# EAGLE design E-P-099-R2.5 (EAGLE 7.5.0)
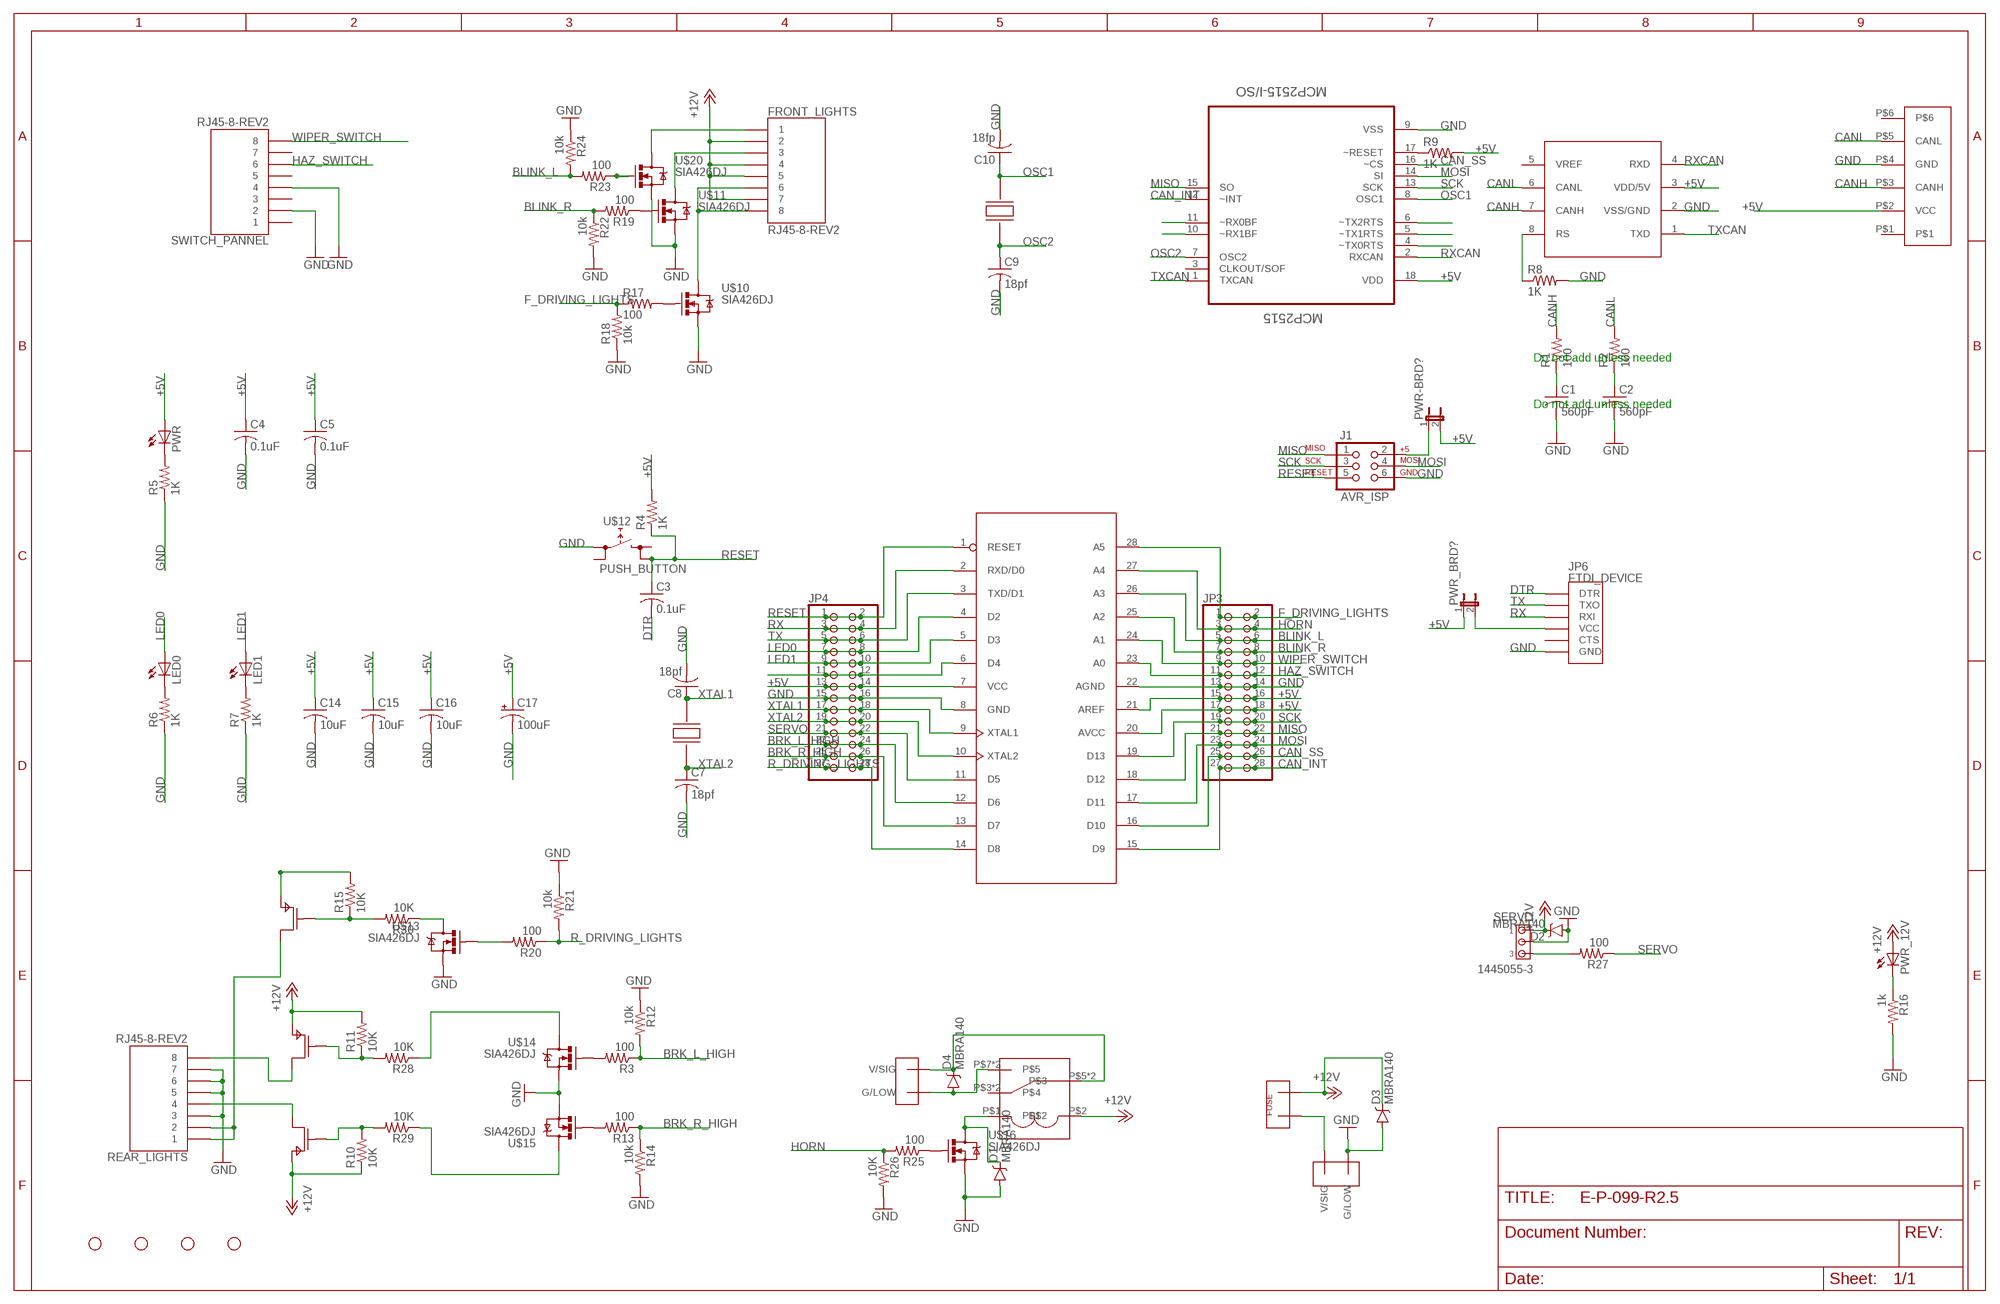
[diagram p0: schematic, sheet 1]

## Parts
C1  560pF  C-USC0805  [C0805]
C2  560pF  C-USC0805  [C0805]
C3  0.1uF  C-USC0805  [C0805]
C4  0.1uF  C-USC0805  [C0805]
C5  0.1uF  C-USC0805  [C0805]
C7  18pf  C-USC0805  [C0805]
C8  18pf  C-USC0805  [C0805]
C9  18pf  C-USC0805  [C0805]
C10  18fp  C-USC0805  [C0805]
C14  10uF  C-USC0805  [C0805]
C15  10uF  C-USC0805  [C0805]
C16  10uF  C-USC0805  [C0805]
C17  100uF  47UF-50V-20%(ELECT)  [PANASONIC_D]
CAN-BUS  CAN_6P6C  [CAN_6P6C]
D1  MBRA140  [SMA-DIODE]
D2  MBRA140  [SMA-DIODE]
D3  MBRA140  [SMA-DIODE]
D4  MBRA140  [SMA-DIODE]
FRONT_LIGHTS  RJ45-8-REV2  [RJ45-8]
HORN  TE770966  [2X1-MATE-N-LOCK]
J1  AVR_ISP  AVR_SPI_PRG_6PTH  [2X3]
JP3  PINHD-2X14  [2X14]
JP4  PINHD-2X14  [2X14]
JP6  FTDI_DEVICE  [FTDI_DEVICE_SIDE]
LED0  LED1206  [LED-1206]
LED1  LED1206  [LED-1206]
MCP2515  MCP2515-I/SO  [SOIC127P1034X264-18N]
PWR  LED1206  [LED-1206]
PWR-BRD?  JP1E  [JP1]
PWR_12V  LEDCHIPLED_1206  [CHIPLED_1206]
PWR_BRD?  JP1E  [JP1]
R1  100  R-US_M0805  [M0805]
R2  100  R-US_M0805  [M0805]
R3  100  R-US_M0805  [M0805]
R4  1K  R-US_M0805  [M0805]
R5  1K  R-US_M0805  [M0805]
R6  1K  R-US_M0805  [M0805]
R7  1K  R-US_M0805  [M0805]
R8  1K  R-US_M0805  [M0805]
R9  1K  R-US_M0805  [M0805]
R10  10K  R-US_M0805  [M0805]
R11  10K  R-US_M0805  [M0805]
R12  10k  R-US_M0805  [M0805]
R13  100  R-US_M0805  [M0805]
R14  10k  R-US_M0805  [M0805]
R15  10K  R-US_M0805  [M0805]
R16  1k  R-US_M0805  [M0805]
R17  100  R-US_M0805  [M0805]
R18  10k  R-US_M0805  [M0805]
R19  100  R-US_M0805  [M0805]
R20  100  R-US_M0805  [M0805]
R21  10k  R-US_M0805  [M0805]
R22  10k  R-US_M0805  [M0805]
R23  100  R-US_M0805  [M0805]
R24  10k  R-US_M0805  [M0805]
R25  100  R-US_M0805  [M0805]
R26  10K  R-US_M0805  [M0805]
R27  100  R-US_M0805  [M0805]
R28  10K  R-US_M0805  [M0805]
R29  10K  R-US_M0805  [M0805]
R30  10K  R-US_M0805  [M0805]
REAR_LIGHTS  RJ45-8-REV2  [RJ45-8]
SERVO  1445055-3  [1445055-3]
STANDOFF1  STAND-OFF  [STAND-OFF]
STANDOFF2  STAND-OFF  [STAND-OFF]
STANDOFF3  STAND-OFF  [STAND-OFF]
STANDOFF4  STAND-OFF  [STAND-OFF]
SWITCH_PANNEL  RJ45-8-REV2  [RJ45-8]
U$2  MCP2551DIP  [DIP8]
U$3  SIA449DJ  [SIA449DJ-T1-GE3CT-ND]
U$4  ATMEGA328  [DIP28-0.3IN]
U$5  SIA449DJ  [SIA449DJ-T1-GE3CT-ND]
U$6  SIA449DJ  [SIA449DJ-T1-GE3CT-ND]
U$7  RELAY  [RTD34012]
U$8  TE770966  [2X1-MATE-N-LOCK]
U$9  FUSEMINI-BLADE  [MINI-BLADE-FUSE]
U$10  SIA426DJ  [SC70-6L]
U$11  SIA426DJ  [SC70-6L]
U$12  PUSH_BUTTON  [PUSHBUTTON]
U$13  SIA426DJ  [SC70-6L]
U$14  SIA426DJ  [SC70-6L]
U$15  SIA426DJ  [SC70-6L]
U$16  SIA426DJ  [SC70-6L]
U$18  CRYSTAL  [7A_CRYSTAL]
U$19  CRYSTAL  [7A_CRYSTAL]
U$20  SIA426DJ  [SC70-6L]

## Nets
+5V: C4.1 C5.1 C14.1 C15.1 C16.1 C17.+ CAN-BUS.P$2(VCC) JP3.15 JP3.16 JP3.17 JP3.18 JP4.13 JP4.14 MCP2515.18(VDD) PWR-BRD?.2 PWR.A PWR_BRD?.1 R4.2 R9.2 U$2.3(VDD/5V) U$4.7(VCC) U$4.20(AVCC) U$4.21(AREF)
+12V: D2.C D3.C FRONT_LIGHTS.2 FRONT_LIGHTS.4 FRONT_LIGHTS.5 FRONT_LIGHTS.7 PWR_12V.A R10.1 R11.2 R15.2 SERVO.1 U$3.P$4(P$S) U$3.P$5(P$S) U$5.P$4(P$S) U$5.P$5(P$S) U$6.P$4(P$S) U$6.P$5(P$S) U$7.P$2 U$9.OUT
BLINK_L: JP3.5 JP3.6 R23.2 R24.2 U$4.26(A3)
BLINK_R: JP3.7 JP3.8 R19.2 R22.1 U$4.25(A2)
BRK_L_HIGH: JP4.23 JP4.24 R3.1 R12.2 U$4.12(D6)
BRK_R_HIGH: JP4.25 JP4.26 R13.1 R14.1 U$4.13(D7)
CAN_INT: JP3.27 JP3.28 MCP2515.12(~INT) U$4.15(D9)
CAN_SS: JP3.25 JP3.26 MCP2515.16(~CS) U$4.16(D10)
CANH: CAN-BUS.P$3(CANH) R1.2 U$2.7(CANH)
CANL: CAN-BUS.P$5(CANL) R2.2 U$2.6(CANL)
DTR: C3.2 JP6.P$1(DTR)
F_DRIVING_LIGHTS: JP3.1 JP3.2 R17.1 R18.2 U$4.28(A5)
GND: C1.2 C2.2 C4.2 C5.2 C7.2 C8.2 C9.2 C10.2 C14.2 C15.2 C16.2 C17.- CAN-BUS.P$4(GND) D1.A D2.A D3.A J1.6 JP3.13 JP3.14 JP4.15 JP4.16 JP6.P$6(GND) MCP2515.9(VSS) R5.1 R6.1 R7.1 R8.2 R12.1 R14.2 R16.2 R18.1 R21.1 R22.2 R24.1 R26.2 REAR_LIGHTS.3 REAR_LIGHTS.5 REAR_LIGHTS.6 REAR_LIGHTS.7 SERVO.2 SWITCH_PANNEL.2 SWITCH_PANNEL.4 U$2.2(VSS/GND) U$4.8(GND) U$4.22(AGND) U$8.CIRCUIT2(G/LOW) U$10.S@0(S) U$10.S@1(S) U$11.S@0(S) U$11.S@1(S) U$12.L1(L) U$13.S@0(S) U$13.S@1(S) U$14.S@0(S) U$14.S@1(S) U$15.S@0(S) U$15.S@1(S) U$16.S@0(S) U$16.S@1(S) U$20.S@0(S) U$20.S@1(S)
HAZ_SWITCH: JP3.11 JP3.12 SWITCH_PANNEL.6 U$4.23(A0)
HORN: JP3.3 JP3.4 R25.2 R26.1 U$4.27(A4)
LED0: JP4.7 JP4.8 LED0.A U$4.4(D2)
LED1: JP4.9 JP4.10 LED1.A U$4.5(D3)
MISO: J1.1 JP3.21 JP3.22 MCP2515.15(SO) U$4.18(D12)
MOSI: J1.4 JP3.23 JP3.24 MCP2515.14(SI) U$4.17(D11)
N$1: MCP2515.4(~TX0RTS)
N$2: MCP2515.5(~TX1RTS)
N$3: MCP2515.6(~TX2RTS)
N$4: MCP2515.11(~RX0BF)
N$5: REAR_LIGHTS.4 U$6.P$1(P$D)
N$6: REAR_LIGHTS.8 U$5.P$1(P$D)
N$7: R13.2 U$15.G
N$8: R20.2 U$13.G
N$9: JP6.P$4(VCC) PWR_BRD?.2
N$10: LED0.C R6.2
N$11: LED1.C R7.2
N$12: R8.1 U$2.8(RS)
N$13: REAR_LIGHTS.1 REAR_LIGHTS.2 U$3.P$1(P$D)
N$14: R11.1 R28.2 U$5.P$6(P$G)
N$15: MCP2515.17(~RESET) R9.1
N$16: PWR_12V.C R16.1
N$17: R23.1 U$20.G
N$18: D4.C HORN.CIRCUIT1(V/SIG) U$7.P$5 U$7.P$6
N$19: PWR.C R5.2
N$20: FRONT_LIGHTS.1 U$20.D
N$21: R3.2 U$14.G
N$22: R15.1 R30.2 U$3.P$6(P$G)
N$23: FRONT_LIGHTS.3 U$11.D
N$24: MCP2515.10(~RX1BF)
N$25: C1.1 R1.1
N$26: C2.1 R2.1
N$27: FRONT_LIGHTS.6 FRONT_LIGHTS.8 U$10.D
N$28: D4.A HORN.CIRCUIT2(G/LOW) U$7.P$7 U$7.P$8
N$29: R25.1 U$16.G
N$30: D1.C U$7.P$1 U$16.D
N$32: R10.2 R29.2 U$6.P$6(P$G)
N$33: R19.1 U$11.G
N$34: R30.1 U$13.D
N$35: R17.2 U$10.G
N$36: R27.2 SERVO.3
N$37: J1.2 PWR-BRD?.1
N$38: JP4.11 JP4.12 U$4.6(D4)
N$43: R28.1 U$14.D
N$45: R29.1 U$15.D
N$47: U$8.CIRCUIT1(V/SIG) U$9.IN
OSC1: C10.1 MCP2515.8(OSC1) U$19.P$2
OSC2: C9.1 MCP2515.7(OSC2) U$19.P$1
R_DRIVING_LIGHTS: JP4.27 JP4.28 R20.1 R21.2 U$4.14(D8)
RESET: C3.1 J1.5 JP4.1 JP4.2 R4.1 U$4.1(RESET) U$12.R2(R)
RX: JP4.3 JP4.4 JP6.P$3(RXI) U$4.2(RXD/D0)
RXCAN: MCP2515.2(RXCAN) U$2.4(RXD)
SCK: J1.3 JP3.19 JP3.20 MCP2515.13(SCK) U$4.19(D13)
SERVO: JP4.21 JP4.22 R27.1 U$4.11(D5)
TX: JP4.5 JP4.6 JP6.P$2(TXO) U$4.3(TXD/D1)
TXCAN: MCP2515.1(TXCAN) U$2.1(TXD)
WIPER_SWITCH: JP3.9 JP3.10 SWITCH_PANNEL.8 U$4.24(A1)
XTAL1: C8.1 JP4.17 JP4.18 U$4.9(XTAL1) U$18.P$2
XTAL2: C7.1 JP4.19 JP4.20 U$4.10(XTAL2) U$18.P$1
Unconnected: CAN-BUS.P$1 CAN-BUS.P$6 JP6.P$5(CTS) MCP2515.3(CLKOUT/SOF) SWITCH_PANNEL.1 SWITCH_PANNEL.3 SWITCH_PANNEL.5 SWITCH_PANNEL.7 U$2.5(VREF) U$7.P$3 U$7.P$4 U$12.L2(L) U$12.R1(R)

## Notes on the sheet
- Do not add unless needed
- Do not add unless needed

## Library data of the parts
C1-C5 C7-C10 C14-C16 = adafruit:C-US: CAPACITOR, American symbol
C17 = SparkFun-Capacitors:47UF-50V-20%(ELECT): CAP-10547; PROD_ID: CAP-10547
CAN-BUS = Shell2013:CAN_6P6C: Digikey part: 553-2258-ND
D1-D4 = SparkFun-DiscreteSemi:MBRA140: 40V, 1A Schottky rectifier SMA/DO-214AC package DIO-08053; PROD_ID: DIO-08053
FRONT_LIGHTS REAR_LIGHTS SWITCH_PANNEL = E14-P-099-R21.2(US_drills):RJ45-8-REV2
HORN U$8 = Shell2013(1):TE770966
J1 = E-P-099-R2.2:AVR_SPI_PRG_6: AVR ISP 6 Pin This is the reduced ISP connector for AVR programming. Common on Arduino. This footprint will take up less PCB space and can be used with a 10-pin to 6-pin adapter such as SKU: BOB-08508
JP3 JP4 = E-P-099-R2.2:PINHD-2X14: PIN HEADER
JP6 = SparkFun-Connectors:FTDI_DEVICE: Connector which mates to FTDI basic or FTDI cable.
LED0 LED1 PWR = Shell2013:LED: LEDs Standard schematic elements and footprints for 5mm, 3mm, 1206, and 0603 sized LEDs. 5mm - Spark Fun Electronics SKU : COM-00529 (and others)
MCP2515 = Microchip_By_element14_Batch_1:MCP2515-I/SO: CAN Controller; MPN: MCP2515-I/SO; OC_FARNELL: 1292239; OC_NEWARK: 29H7136; PACKAGE: SOIC-18; SUPPLIER: Microchip
PWR-BRD? PWR_BRD? = E-P-099-R2.2:JP1E: JUMPER
PWR_12V = E14-P-099-R21.2(US_drills):LED: LED OSRAM: - CHIPLED LG R971, LG N971, LY N971, LG Q971, LY Q971, LO R971, LY R971 LH N974, LH R974 LS Q976, LO Q976, LY Q976 LO Q996 - Hyper CHIPLED LW Q18S LB Q993, LB Q99A, LB R99A - SideLED LS A670, LO A670, LY A670, LG A670, LP A670 LB A673, LV A673, LT A673, LW A673 LH A674 LY A675 LS A676, LA A676, LO A676, LY A676, LW A676 LS A679, LY A679, LG A679 - Hyper Micro SIDELED® LS Y876, LA Y876, LO Y876, LY Y876 LT Y87S - SmartLED LW L88C, LW L88S LB L89C, LB L89S, LG L890 LS L89K, LO L89K, LY L89K LS L896, LA L896, LO L896, LY L896 - TOPLED LS T670, LO T670, LY T670, LG T670, LP T670 LSG T670, LSP T670, LSY T670, LOP T670, LYG T670 LG T671, LOG T671, LSG T671 LB T673, LV T673, LT T673, LW T673 LH T674 LS T676, LA T676, LO T676, LY T676, LB T676, LH T676, LSB T676, LW T676 LB T67C, LV T67C, LT T67C, LS T67K, LO T67K, LY T67K, LW E67C LS E67B, LA E67B, LO E67B, LY E67B, LB E67C, LV E67C, LT E67C LW T67C LS T679, LY T679, LG T679 LS T770, LO T770, LY T770, LG T770, LP T770 LB T773, LV T773, LT T773, LW T773 LH T774 LS E675, LA E675, LY E675, LS T675 LS T776, LA T776, LO T776, LY T776, LB T776 LHGB T686 LT T68C, LB T68C - Hyper Mini TOPLED® LB M676 - Mini TOPLED Santana® LG M470 LS M47K, LO M47K, LY M47K Source: http://www.osram.convergy.de LUXEON: - LUMILED® LXK2-PW12-R00, LXK2-PW12-S00, LXK2-PW14-U00, LXK2-PW14-V00 LXK2-PM12-R00, LXK2-PM12-S00, LXK2-PM14-U00 LXK2-PE12-Q00, LXK2-PE12-R00, LXK2-PE12-S00, LXK2-PE14-T00, LXK2-PE14-U00 LXK2-PB12-K00, LXK2-PB12-L00, LXK2-PB12-M00, LXK2-PB14-N00, LXK2-PB14-P00, LXK2-PB14-Q00 LXK2-PR12-L00, LXK2-PR12-M00, LXK2-PR14-Q00, LXK2-PR14-R00 LXK2-PD12-Q00, LXK2-PD12-R00, LXK2-PD12-S00 LXK2-PH12-R00, LXK2-PH12-S00 LXK2-PL12-P00, LXK2-PL12-Q00, LXK2-PL12-R00 Source: www.luxeon.com KINGBRIGHT: KA-3528ASYC Source: www.kingbright.com
R1-R30 = adafruit:R-US_: RESISTOR, American symbol
SERVO = con-amp:1445055-3: Micro MATE-N-LOK Connectors grid 1.5 mm Source: ENG_CD_1445055_A.pdf
STANDOFF1-STANDOFF4 = SparkFun-Electromechanical:STAND-OFF: #4 Stand Off This is the mechanical footprint for a #4 phillips button head screw. Use the keepout ring to avoid running the screw head into surrounding components. SKU : PRT-00447
U$2 = E-P-099-R2.2:MCP2551
U$3 U$5 U$6 = Shell2015:SIA449DJ: 30V 12A P-Mosfet Digikey: SIA449DJ-T1-GE3CT-ND
U$4 = E-P-099-R2.2:ATMEGA328
U$7 = mylibrary:RELAY
U$9 = Shell2013:FUSE
U$10 U$11 U$13-U$16 U$20 = Shell2013:SIA426DJ
U$12 = E-P-099-R2.2:PUSH_BUTTON
U$18 U$19 = mylibrary:CRYSTAL

## Board
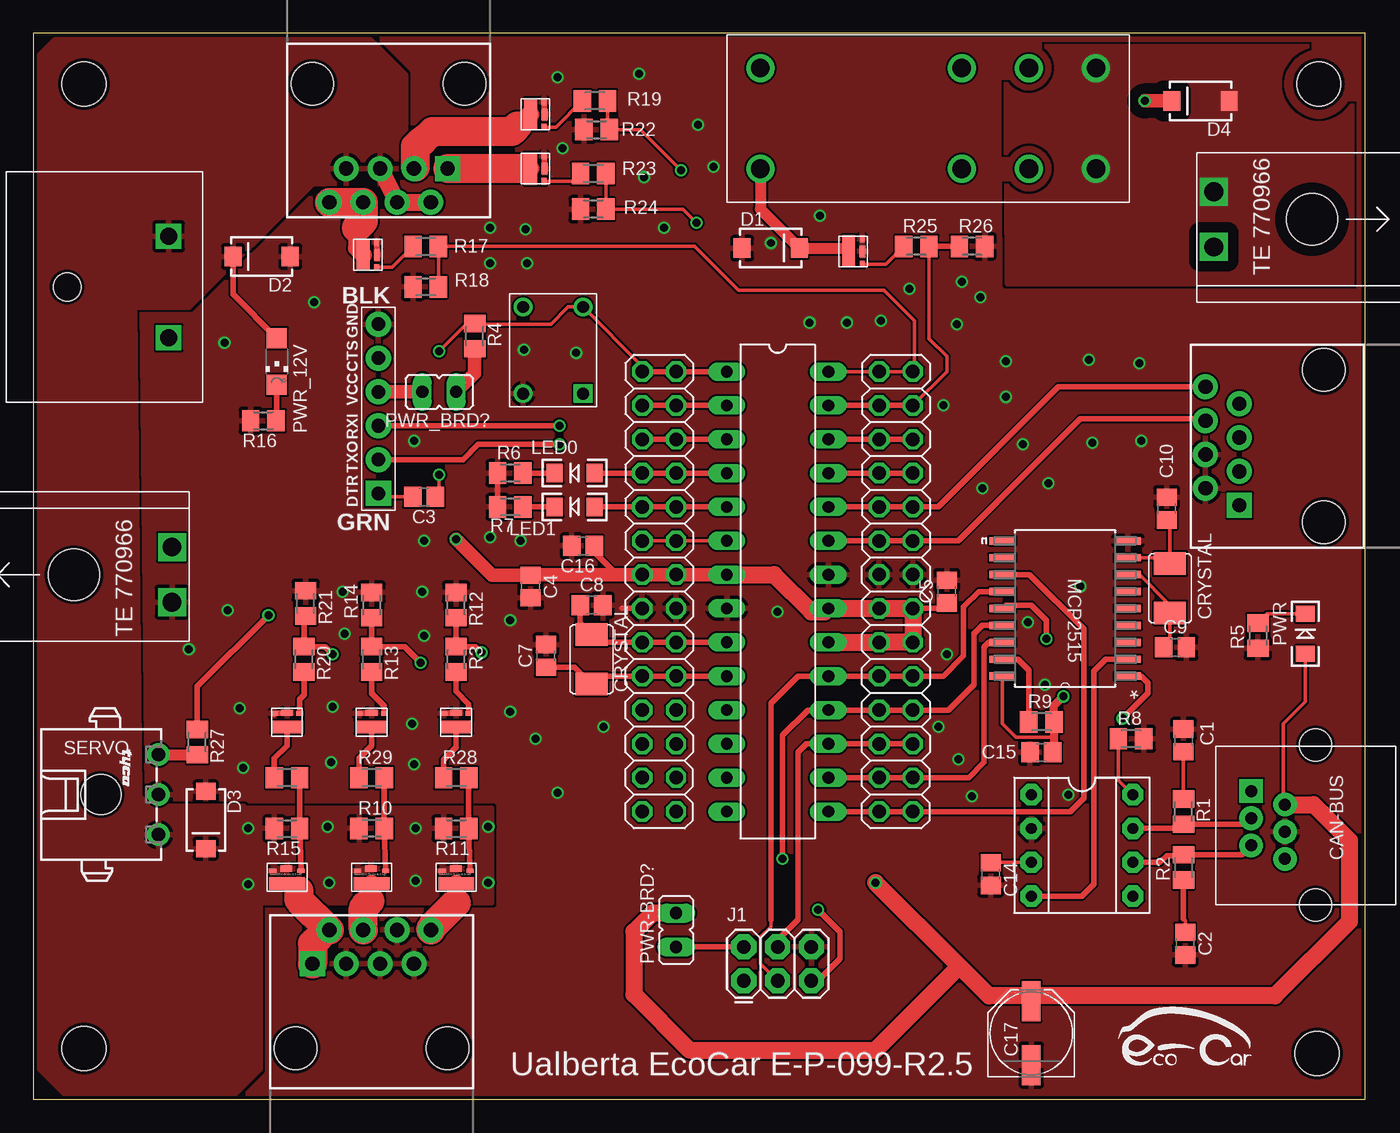
[diagram p1: board, top side]
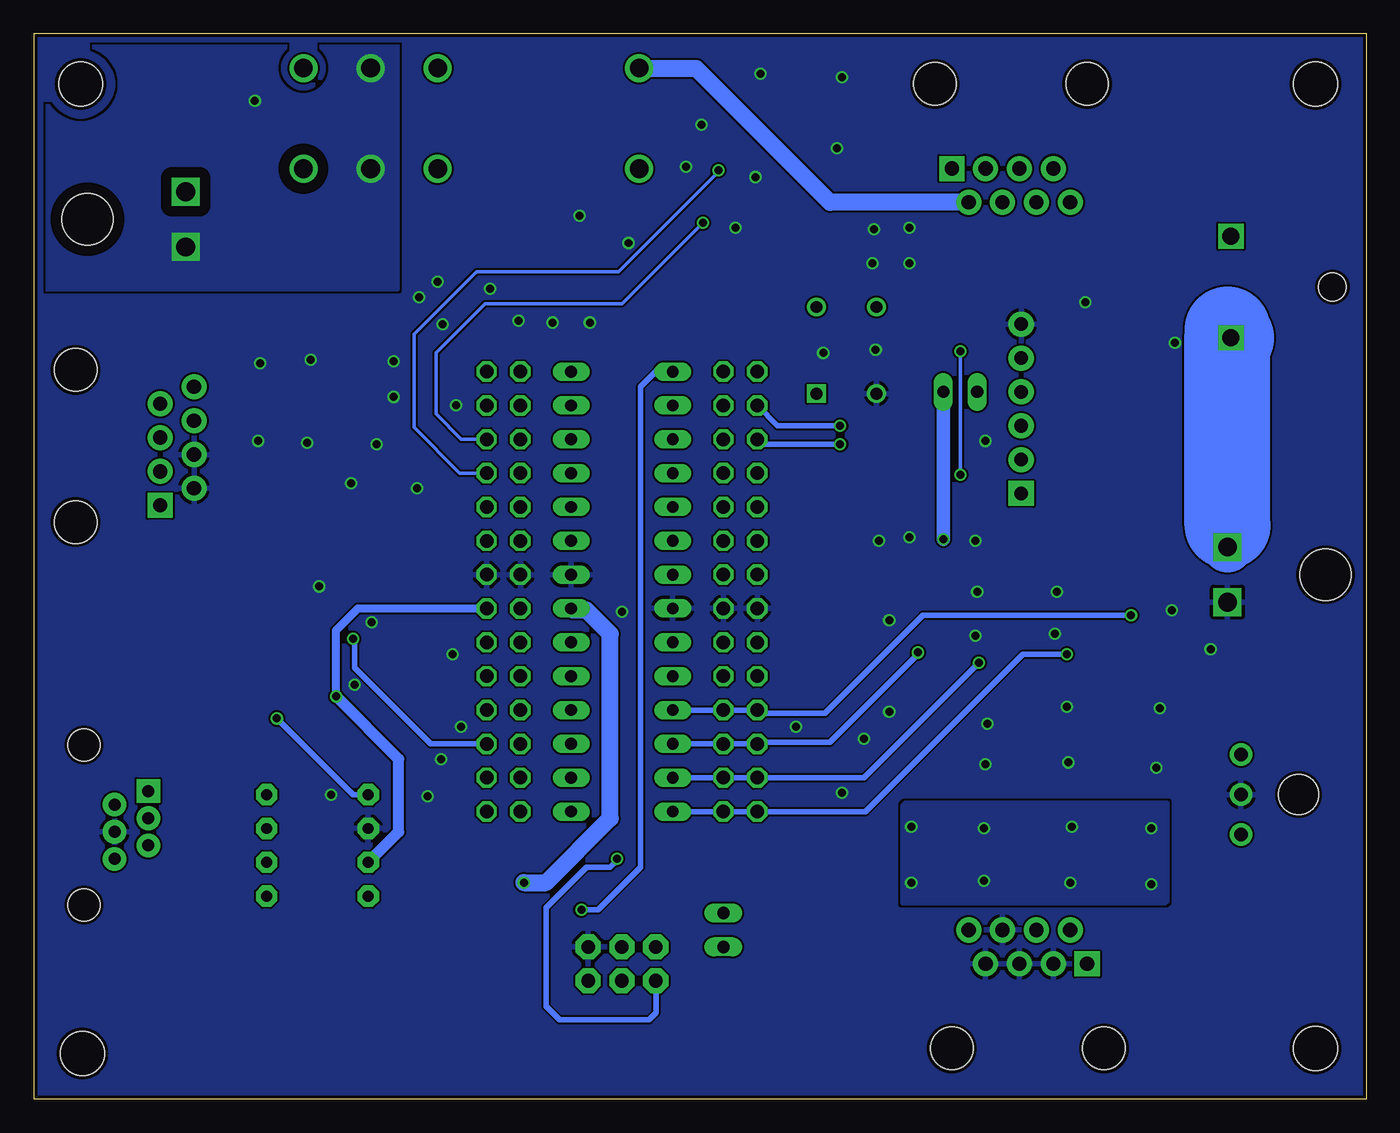
[diagram p2: board, bottom side, seen from below]

Size 100 x 80 mm. Coordinates in mm from the lower left corner, seen from the top.
Outline: 0,0 100,0 100,80 0,80 0,0
Copper layers (1*16): Top 0.035mm / dielectric 1.5mm / Bottom 0.035mm
Design rules "SeeedStudio_2layer_DRU_no_angle_20140221": minimum track width 6mil, minimum drill 12mil, track to track 6mil, track to pad 6mil, pad to pad 6mil, via to via 6mil, smd to smd 0mil, copper to edge 10mil, drill to drill 10mil, minimum pad ring 10mil, minimum via ring 6mil, stop-mask expansion 2mil, vias tented up to drill 100mil, thermal gap 10mil

### Footprints (pad centres in the part's own frame; a part is rotated, then mirrored left to right if it is on the bottom)
C0805 = smd 1.3 x 1.5: 1 -0.85,0; 2 0.85,0
PANASONIC_D = smd 3 x 1.4: + 2.4,0; - -2.4,0
CAN_6P6C = drill 0.9 pad 1.778 square: P$1 4.08,0 | drill 0.9 pad 1.778: P$2 3.06,-2.54; P$3 2.04,0; P$4 1.02,-2.54; P$5 0,0; P$6 -1.02,-2.54 | hole 2.4: -4.47,-4.84; 7.53,-4.84
SMA-DIODE = smd 1.27 x 1.47: A -2.15,0; C 2.15,0
RJ45-8 = drill 1.067 pad 1.88 square: 1 -4.445,6.35 | drill 1.067 pad 1.88: 2 -3.175,8.89; 3 -1.905,6.35; 4 -0.635,8.89; 5 0.635,6.35; 6 1.905,8.89; 7 3.175,6.35; 8 4.445,8.89 | hole 3.2: -5.715,0; 5.715,0
2X1-MATE-N-LOCK = drill 1.4 square: CIRCUIT1 -2.07,14.23; CIRCUIT2 2.07,14.23 | hole 3.86: 0,6.86
2X3 = drill 1.016 pad 1.88 octagon: 1 0,0; 2 0,2.54; 3 2.54,0; 4 2.54,2.54; 5 5.08,0; 6 5.08,2.54
2X14 = drill 1.016 octagon: 1 -16.51,-1.27; 2 -16.51,1.27; 3 -13.97,-1.27; 4 -13.97,1.27; 5 -11.43,-1.27; 6 -11.43,1.27; 7 -8.89,-1.27; 8 -8.89,1.27; 9 -6.35,-1.27; 10 -6.35,1.27; 11 -3.81,-1.27; 12 -3.81,1.27; 13 -1.27,-1.27; 14 -1.27,1.27; 15 1.27,-1.27; 16 1.27,1.27; 17 3.81,-1.27; 18 3.81,1.27; 19 6.35,-1.27; 20 6.35,1.27; 21 8.89,-1.27; 22 8.89,1.27; 23 11.43,-1.27; 24 11.43,1.27; 25 13.97,-1.27; 26 13.97,1.27; 27 16.51,-1.27; 28 16.51,1.27
FTDI_DEVICE_SIDE = drill 1.016 pad 1.88 square: P$1 -6.35,0 | drill 1.016 pad 1.88: P$2 -3.81,0; P$3 -1.27,0; P$4 1.27,0; P$5 3.81,0; P$6 6.35,0
LED-1206 = smd 1.2 x 1.4: A -1.5,0; C 1.5,0
SOIC127P1034X264-18N = smd 1.981 x 0.559: 1 -4.699,5.08; 2 -4.699,3.81; 3 -4.699,2.54; 4 -4.699,1.27; 5 -4.699,0; 6 -4.699,-1.27; 7 -4.699,-2.54; 8 -4.699,-3.81; 9 -4.699,-5.08; 10 4.699,-5.08; 11 4.699,-3.81; 12 4.699,-2.54; 13 4.699,-1.27; 14 4.699,0; 15 4.699,1.27; 16 4.699,2.54; 17 4.699,3.81; 18 4.699,5.08
JP1 = drill 0.914 long: 1 0,-1.27; 2 0,1.27
CHIPLED_1206 = smd 1.5 x 1.5: A 0,-1.75; C 0,1.75
M0805 = smd 1.3 x 1.6: 1 -0.95,0; 2 0.95,0
1445055-3 = drill 1 pad 1.676: 1 3,4.32; 2 0,4.32; 3 -3,4.32 | hole 3: 0,0
STAND-OFF = hole 3.302: 0,0
DIP8 = drill 0.813 pad 1.6 octagon: 1 1.27,-3.81; 2 3.81,-3.81; 3 6.35,-3.81; 4 8.89,-3.81; 5 8.89,3.81; 6 6.35,3.81; 7 3.81,3.81; 8 1.27,3.81
SIA449DJ-T1-GE3CT-ND = smd 0.95 x 2.67: P$1 -0.325,0 | smd 0.3 x 0.55: P$4 0.65,1.05; P$6 0.65,-1.05 | smd 0.5 x 0.87: P$5 0.8,0.04
DIP28-0.3IN = drill 0.889 long: 1 -16.51,-3.81; 2 -13.97,-3.81; 3 -11.43,-3.81; 4 -8.89,-3.81; 5 -6.35,-3.81; 6 -3.81,-3.81; 7 -1.27,-3.81; 8 1.27,-3.81; 9 3.81,-3.81; 10 6.35,-3.81; 11 8.89,-3.81; 12 11.43,-3.81; 13 13.97,-3.81; 14 16.51,-3.81; 15 16.51,3.81; 16 13.97,3.81; 17 11.43,3.81; 18 8.89,3.81; 19 6.35,3.81; 20 3.81,3.81; 21 1.27,3.81; 22 -1.27,3.81; 23 -3.81,3.81; 24 -6.35,3.81; 25 -8.89,3.81; 26 -11.43,3.81; 27 -13.97,3.81; 28 -16.51,3.81
RTD34012 = drill 1.4: P$1 2.52,2.52; P$2 2.52,10.08; P$3 17.64,10.08; P$4 17.64,2.52; P$5 22.68,2.52; P$6 22.68,10.08; P$7 27.72,10.08; P$8 27.72,2.52
MINI-BLADE-FUSE = drill 1.27 square: IN 3.81,7.62; OUT -3.81,7.62 | hole 2.083: 0,0
SC70-6L = smd 0.95 x 2.4: D 0,0 | smd 0.35 x 0.5: G 1.01,-0.95; S@0 1.01,0.95 | smd 0.45 x 0.87: S@1 1.05,0
PUSHBUTTON = drill 0.889: L1 0,4.5; R1 6.5,4.5; R2 6.5,0 | drill 0.889 square: L2 0,0
7A_CRYSTAL = smd 1.7 x 2.4: P$1 -1.85,0; P$2 1.85,0

### Placement (x,y rotation side)
C1  86.36,26.92 90 top
C2  86.49,11.68 270 top
C3  29.34,45.21 180 top
C4  37.34,38.48 270 top
C5  68.58,38.1 90 top
C7  [C0805]  38.48,33.27 90 top
C8  [C0805]  41.91,37.08 0 top
C9  [C0805]  85.72,33.91 0 top
C10  [C0805]  85.09,44.32 90 top
C14  71.88,16.89 270 top
C15  75.69,26.04 180 top
C16  41.27,41.53 180 top
C17  74.93,4.95 90 top
CAN-BUS  91.44,19.05 90 top
D1  55.37,63.88 0 top
D2  17.14,63.25 180 top
D3  12.95,20.95 270 top
D4  87.63,74.93 180 top
FRONT_LIGHTS  26.67,76.2 180 top
HORN  102.87,66.04 90 top
J1  53.34,8.89 0 top
JP3  64.77,38.1 270 top
JP4  46.99,38.1 270 top
JP6  25.91,51.82 90 top
LED0  40.64,46.99 180 top
LED1  40.64,44.45 180 top
MCP2515  77.47,36.83 180 top
PWR  95.5,34.92 90 top
PWR-BRD?  48.26,12.7 0 top
PWR_12V  18.29,55.37 180 top
PWR_BRD?  30.48,53.09 90 top
R1  86.36,21.59 270 top
R2  86.36,17.4 90 top
R3  31.75,33.02 270 top
R4  33.15,57.28 270 top
R5  91.95,34.8 90 top
R6  35.81,46.99 0 top
R7  35.81,44.45 0 top
R8  82.42,27.05 0 top
R9  75.69,28.32 0 top
R10  25.4,20.32 0 top
R11  31.75,20.32 180 top
R12  31.75,37.08 270 top
R13  25.4,33.02 270 top
R14  25.4,37.08 90 top
R15  19.05,20.32 180 top
R16  17.27,50.93 180 top
R17  29.46,64.01 180 top
R18  29.46,60.96 0 top
R19  42.16,74.93 0 top
R20  20.32,33.02 270 top
R21  20.45,37.21 270 top
R22  42.29,72.77 180 top
R23  42.04,69.47 0 top
R24  42.04,66.8 0 top
R25  66.29,64.01 0 top
R26  70.48,64.01 0 top
R27  12.32,26.8 270 top
R28  31.75,24.13 0 top
R29  25.4,24.13 0 top
R30  19.05,24.13 0 top
REAR_LIGHTS  25.4,3.81 0 top
SERVO  5.08,22.86 270 top
STANDOFF1  96.39,3.43 0 top
STANDOFF2  96.52,76.2 0 top
STANDOFF3  3.81,3.81 0 top
STANDOFF4  3.81,76.2 0 top
SWITCH_PANNEL  96.9,49.02 90 top
U$2  78.74,24.13 270 top
U$3  19.05,16.51 90 top
U$4  55.88,38.1 270 top
U$5  31.75,16.51 90 top
U$6  25.4,16.51 90 top
U$7  52.07,67.31 0 top
U$8  -3.81,39.37 270 top
U$9  2.54,60.96 270 top
U$10  24.77,63.37 0 top
U$11  37.34,73.91 0 top
U$12  41.27,52.96 90 top
U$13  19.05,27.94 90 top
U$14  31.75,27.94 90 top
U$15  25.4,27.94 90 top
U$16  61.21,63.63 0 top
U$18  41.91,33.02 90 top
U$19  85.34,38.35 90 top
U$20  37.34,69.85 0 top

### Tracks (layer width: path | path; a pad name or v marks a point on that pad's centre or on a via)
+5V  (via drill 0.6)
  Top 0.254: U$2.3 71.92,17.78 C14.1 | PWR.A 95.5,29.84 93.85,28.19 93.85,22.24 CAN-BUS.P$2 | MCP2515.18 72.77,28.19 73.79,27.18 76.64,27.18
  Top 0.406: C4.1 37.38,39.37 | JP3.16 68.16,36.83 C5.1 | C16.1 42.12,41.06 43.81,39.37
  Top 0.61: v77.34,30.23 76.64,29.52 R9.2 76.64,27.18 76.64,26.14 C15.1
  Top 1.016: U$4.7 JP4.14 JP4.13 43.81,39.37 37.38,39.37 | v31.75,42.04 34.46,39.33 C4.1 | R4.2 33.15,54.48 PWR_BRD?.1
  Top 1.27: CAN-BUS.P$2 96.13,22.11 98.81,19.43 98.81,13.34 93.22,7.75 75.32,7.75 | 75.32,7.75 C17.+ | 75.32,7.75 71.75,7.75 69.53,9.97 | 69.53,9.97 v63.25,16.26 | PWR-BRD?.2 46.48,13.97 45.09,12.57 45.09,7.87 49.28,3.68 63.25,3.68 69.53,9.97 | U$4.7 55.63,39.37 58.42,36.58 59.44,36.58 U$4.21 JP3.15 JP3.16 JP3.18 JP3.17 U$4.20
  Bottom 0.61: v77.34,30.23 77.34,35.18 75.69,36.83 JP3.16
  Bottom 0.813: U$2.3 72.64,20.07 72.64,25.53 v77.34,30.23
  Bottom 1.016: PWR_BRD?.1 v31.75,42.04
  Bottom 1.27: v63.25,16.26 61.59,16.26 56.77,21.08 56.77,34.92 58.55,36.7 59.56,36.7 U$4.21
+12V  (via drill 0.6)
  Top 0.406: D2.C 14.99,60.41 PWR_12V.A
  Top 1.27: FRONT_LIGHTS.5 FRONT_LIGHTS.4 FRONT_LIGHTS.2
  Bottom 1.27: FRONT_LIGHTS.2 40.26,67.31 50.29,77.34 54.54,77.34 U$7.P$2
  other vias: 16.13,16.13 16.13,20.32 22.1,20.45 22.23,16.26 28.7,16.38 28.7,20.32 34.16,16.26 34.16,20.45
  pour Top: 16.13,21.84 34.42,21.84 34.42,14.73 16.13,14.73
  pour Top (rank 3): 7.62,59.44 11.68,59.44 20.95,68.71 26.42,68.71 27.94,70.23 27.94,76.83 25.27,79.5 1.65,79.5 0.38,78.23 0.38,2.41 2.41,0.38 15.11,0.38 17.02,2.29 17.02,20.7 15.75,21.97 8.76,21.97 8,22.73
  pour Bottom: 14.99,22.23 14.99,14.86 15.11,14.73 34.8,14.73 34.8,21.97 34.54,22.23 15.37,22.23 15.11,22.23
BLINK_L  (via drill 0.6)
  Top 0.254: R23.2 R24.2 48.77,66.8 v49.78,65.79
  Top 0.406: U$4.26 JP3.5 JP3.6
  Bottom 0.254: v49.78,65.79 55.88,59.69 66.17,59.69 69.85,56.01 69.85,51.44 67.94,49.53 JP3.6
BLINK_R  (via drill 0.6)
  Top 0.254: R19.2 43.11,72.9 R22.1 45.59,72.77 v48.64,69.72
  Top 0.406: U$4.25 JP3.7 JP3.8
  Bottom 0.254: v48.64,69.72 48.64,69.6 56.13,62.1 66.8,62.1 71.5,57.4 71.5,50.42 68.07,46.99 JP3.8
BRK_L_HIGH  (via drill 0.6)
  Top 0.406: R12.2 R3.1 33.21,33.97 v33.66,33.53
  Bottom 0.406: v33.66,33.53 33.66,33.4 40.26,26.8 45.59,26.8 JP4.23 JP4.24 U$4.12
BRK_R_HIGH  (via drill 0.6)
  Top 0.406: R14.1 R13.1 27.88,33.97 v29.08,32.77
  Bottom 0.406: v29.08,32.77 37.72,24.13 JP4.25 JP4.26 U$4.13
CAN_INT
  Top 0.406: U$4.15 JP3.27 JP3.28 77.85,21.59 78.87,22.61 78.87,35.31 74.8,39.37 MCP2515.12
CAN_SS
  Top 0.406: U$4.16 JP3.25 JP3.26 70.23,24.13 71.37,25.27 71.37,33.91 71.75,34.29 MCP2515.16
CANH
  Top 0.406: CAN-BUS.P$3 90.99,20.64 R1.2 86.04,20.32 U$2.7
CANL
  Top 0.406: U$2.6 84.58,17.78 85.09,18.29 86.3,18.29 R2.2 90.74,18.35 CAN-BUS.P$5
DTR
  Top 0.254: C3.2 26.16,45.21 JP6.P$1
F_DRIVING_LIGHTS
  Top 0.254: U$4.28 JP3.1 JP3.2 66.17,54.74 66.17,58.42 63.88,60.71 52.96,60.71 49.66,64.01 R17.1 R18.2
GND  (via drill 0.6)
  Top 0.406: 44.2,36.83 JP4.15 | 68.16,39.37 C5.2 | U$11.S@1 38.35,73.95 U$11.S@0 | U$20.S@0 38.39,70.76 U$20.S@1 | U$10.S@0 25.77,64.43 U$10.S@1 | R6.1 R7.1 | U$13.S@1 19.01,28.95 U$13.S@0 18.1,28.89 | U$15.S@0 25.36,28.95 U$15.S@1 | U$14.S@0 31.71,28.95 U$14.S@1
  other vias: 15.75,24.89 15.49,29.34 22.48,29.46 22.35,25.27 28.57,25.15 28.45,28.19 23.37,34.92 29.34,34.8 35.81,29.08 39.37,22.99 37.72,27.05 42.8,27.94 35.81,35.94 29.21,38.1 23.24,38.1 14.61,36.7 11.68,33.78 14.35,56.77 21.08,59.82 28.57,49.4 36.83,56.26 40.77,56.01 36.58,41.91 34.29,42.16 29.34,41.91 34.29,62.74 37.08,62.74 36.96,65.28 34.29,65.41 39.75,71.37 39.37,76.71 45.85,69.22 45.47,76.96 49.91,73.15 59.05,66.29 65.79,60.83 63.63,58.42 61.09,58.29 58.29,58.29 47.37,65.41 51.05,69.98 55.37,64.26 69.34,58.17 69.72,61.34 71.12,60.2 73.03,55.37 73.03,52.7 68.33,52.07 71.25,45.85 74.3,49.15 79.5,49.28 83.19,49.4 83.06,55.24 79.25,55.5 76.2,46.23 68.58,33.4 55.88,36.58 77.72,22.86 70.48,22.73 78.61,38.48 75.95,31.11 74.68,35.81 69.47,25.53 67.94,27.94
  pour Bottom (rank 5): -11.43,91.44 101.6,91.44 101.6,-5.08 -11.43,-5.08
  pour Top (rank 6): -24.13,92.71 104.14,92.71 104.14,-16.51 -24.13,-16.51
HAZ_SWITCH
  Top 0.406: U$4.23 JP3.11 JP3.12 69.47,41.91 78.61,51.05 87.88,51.05 SWITCH_PANNEL.6
HORN
  Top 0.254: R25.2 67.24,57.09 68.58,55.75 68.58,54.61 JP3.4
  Top 0.406: U$4.27 JP3.3 JP3.4 | R25.2 R26.1
LED0
  Top 0.406: U$4.4 JP4.8 JP4.7 LED0.A
LED1
  Top 0.406: U$4.5 JP4.10 JP4.9 LED1.A
MISO  (via drill 0.6)
  Top 0.406: MCP2515.15 71.25,35.56 70.61,34.92 70.61,31.11 68.71,29.21 JP3.22 JP3.21 U$4.18 58.17,29.21 56.26,27.3 v56.26,18.03
  Bottom 0.406: J1.1 53.34,6.48 53.85,5.97 60.58,5.97 61.59,6.99 61.59,14.35 58.55,17.4 56.77,17.4 56.26,17.91 v56.26,18.03
MOSI  (via drill 0.6)
  Top 0.406: JP3.24 JP3.23 U$4.17 58.04,26.67 57.4,26.04 57.4,13.46 55.88,11.94 J1.4 | v76.07,34.54 76.07,35.94 74.93,37.08 73.03,37.08 MCP2515.14
  Bottom 0.406: JP3.24 70.23,26.67 75.95,32.38 75.95,34.42 v76.07,34.54
N$5
  Top 1.27: 25.27,14.86 25.27,16.06 U$6.P$1
  Top 2.184: REAR_LIGHTS.4 24.77,14.35 25.27,14.86
N$6
  Top 1.27: 31.75,14.73 U$5.P$1
  Top 2.184: REAR_LIGHTS.8 29.84,12.83 31.75,14.73
N$7
  Top 0.406: U$15.G 26.35,29.53 25.4,30.48 R13.2
N$8
  Top 0.406: U$13.G 20,30.03 20.32,30.35 R20.2
N$9
  Top 1.016: JP6.P$4 PWR_BRD?.2
N$10
  Top 0.406: R6.2 LED0.C
N$11
  Top 0.406: R7.2 LED1.C
N$12
  Top 0.254: R8.1 81.47,23.94 U$2.8
N$13
  Top 1.016: U$3.P$1 19.38,16.18 19.94,15.62
  Top 2.184: 19.94,15.62 19.94,14.99 REAR_LIGHTS.2 21.97,12.7 20.95,11.68 REAR_LIGHTS.1
N$14
  Top 0.406: U$5.P$6 R11.1 R28.2
N$15
  Top 0.406: MCP2515.17 73.91,33.02 74.74,32.19 R9.1
N$16
  Top 0.406: PWR_12V.C 18.29,50.99 R16.1
N$17
  Top 0.254: U$20.G 40.52,68.9 R23.1
N$18  (via drill 0.6)
  Top 1.016: D4.C v83.44,74.93
  pour Bottom (isolate 0.813, no thermals): 72.77,79.12 99.19,79.12 99.19,60.83 72.77,60.83
N$19
  Top 0.254: PWR.C 92.62,36.42 R5.2
N$20
  Top 1.27: U$20.D 36.83,69.85
  Top 2.184: 36.83,69.85 FRONT_LIGHTS.1
N$21
  Top 0.406: U$14.G 32.7,29.66 31.75,30.61 R3.2
N$22
  Top 0.406: R30.2 R15.1 U$3.P$6
N$23
  Top 1.27: U$11.D 37.21,73.91 36.32,73.03 | 28.7,69.98 FRONT_LIGHTS.3
  Top 2.184: 28.7,69.98 28.7,71.5 29.08,71.88 29.21,71.88 29.97,72.64 35.94,72.64 36.32,73.03
N$25
  Top 0.254: R1.1 C1.1
N$26
  Top 0.254: C2.1 86.49,13.42 86.36,13.55
  Top 0.406: R2.1 86.36,13.55
N$27
  Top 1.27: 24.26,65.41 24.26,63.88 U$10.D
  Top 2.184: FRONT_LIGHTS.8 FRONT_LIGHTS.6 24.77,65.91 24.26,65.41
N$28
  pour Top (isolate 0.813, no thermals): 73.15,61.21 99.82,61.21 99.82,79.88 73.03,79.88
N$29
  Top 0.254: U$16.G 64.01,62.68 R25.1
N$30
  Top 0.813: U$7.P$1 54.59,66.81 D1.C 60.96,63.88 U$16.D
N$32
  Top 0.406: U$6.P$6 R10.2 R29.2
N$33
  Top 0.254: U$11.G 39.25,72.96 R19.1
N$34
  Top 0.406: R30.1 18.1,25.59 19.05,26.54 U$13.D
N$35
  Top 0.254: U$10.G 26.93,62.42 R17.2
N$36
  Top 0.813: SERVO.3 12.31,25.86 R27.2
N$37
  Top 0.406: PWR-BRD?.1 J1.2
N$38
  Top 0.254: JP4.11 JP4.12 U$4.6
N$43
  Top 0.406: R28.1 30.8,25.47 31.75,26.42 U$14.D
N$45
  Top 0.406: R29.1 24.45,25.59 25.4,26.54 U$15.D
N$47
  Bottom 3.81: U$8.CIRCUIT1 10.42,43.05 10.41,43.05
  Bottom 6.452: 10.41,43.05 10.41,57.4 | 10.41,57.78 10.41,57.4 | 10.41,57.4 U$9.IN
OSC1
  Top 0.254: MCP2515.8 84.91,40.64 U$19.P$2 85.34,43.22 C10.1
OSC2
  Top 0.254: C9.1 85.34,34.38 U$19.P$1 85.34,37.08 82.93,39.5 82.3,39.5 MCP2515.7
R_DRIVING_LIGHTS  (via drill 0.6)
  Top 0.406: v22.48,33.4 21.91,33.97 R20.1 20.32,36.13 R21.2
  Bottom 0.406: v22.48,33.4 25.78,33.4 37.59,21.59 JP4.27 JP4.28 U$4.14
RESET  (via drill 0.6)
  Top 0.254: JP4.1 45.72,55.01 U$12.R2 40.16,59.46 38.86,58.17 33.21,58.17 R4.1 32.57,58.23 v30.48,56.13 | v30.48,46.86 30.48,45.51 C3.1
  Top 0.406: JP4.1 JP4.2 U$4.1 | J1.5 58.93,8.89 60.58,10.54 60.58,12.57 v58.93,14.22
  Bottom 0.254: v30.48,56.13 v30.48,46.86
  Bottom 0.406: v58.93,14.22 57.66,14.22 54.48,17.4 54.48,53.47 53.09,54.86 52.32,54.86 U$4.1
RX  (via drill 0.6)
  Top 0.406: JP4.3 JP4.4 U$4.2 | JP6.P$3 v39.5,50.55
  Bottom 0.406: v39.5,50.55 44.2,50.55 JP4.3
RXCAN
  Top 0.406: U$2.4 78.74,15.24 79.63,16.13 79.63,32.13 80.52,33.02 MCP2515.2
SCK
  Top 0.254: 55.37,13.46 55.37,12.95 54.61,12.19 54.61,10.16 J1.3
  Top 0.406: 55.37,13.46 55.37,29.72 57.4,31.75 U$4.19 JP3.19 JP3.20 68.33,31.75 69.85,33.27 69.85,36.96 70.99,38.1 MCP2515.13
SERVO  (via drill 0.6)
  Top 0.406: R27.1 12.32,30.99 v17.65,36.32
  Bottom 0.406: v17.65,36.32 33.27,36.32 40.64,28.96 45.47,28.96 JP4.21 JP4.22 U$4.11
TX  (via drill 0.6)
  Top 0.406: JP4.5 JP4.6 U$4.3 | JP6.P$2 32.26,48.01 33.4,49.15 v39.5,49.15
  Bottom 0.406: v39.5,49.15 45.34,49.15 JP4.5
TXCAN  (via drill 0.6)
  Top 0.406: v81.79,28.57 83.69,30.48 83.69,31.24 83.19,31.75 MCP2515.1
  Bottom 0.406: U$2.1 76.07,22.86 v81.79,28.57
WIPER_SWITCH
  Top 0.406: U$4.24 JP3.9 JP3.10 67.94,44.45 76.96,53.47 SWITCH_PANNEL.8
XTAL1
  Top 0.406: 52.2,34.29 U$4.9 JP4.18 JP4.17 42.49,34.29 U$18.P$2 41.06,35.72 C8.1
XTAL2
  Top 0.406: U$4.10 JP4.20 JP4.19 42.49,31.75 U$18.P$1 40.66,32.42 C7.1

### Text on the board
tPlace: Ualberta EcoCar E-P-099-R2.5